# EAGLE design mr_radar_ferret_afe (EAGLE 6.2)
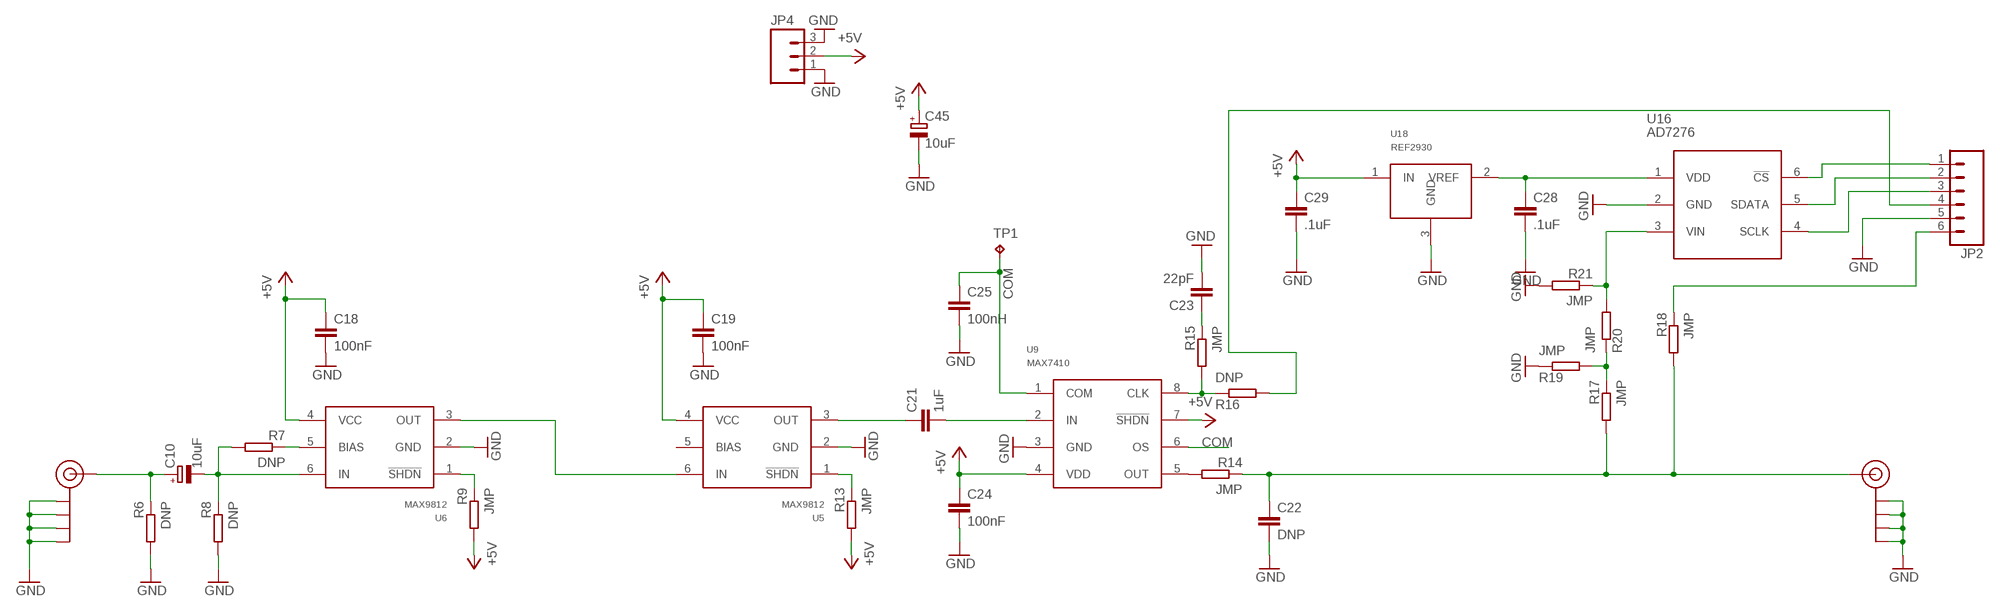
[diagram p0: schematic, sheet 1]

## Parts
C10  10uF  CAPACITOR-POLA  [3216/A]
C18  100nF  CAPACITOR-0603  [0603-CAP]
C19  100nF  CAPACITOR-0603  [0603-CAP]
C21  1uF  CAPACITOR-0603  [0603-CAP]
C22  DNP  CAPACITOR-0603  [0603-CAP]
C23  22pF  CAPACITOR-0603  [0603-CAP]
C24  100nF  CAPACITOR-0603  [0603-CAP]
C25  100nH  CAPACITOR-0603  [0603-CAP]
C28  .1uF  CAPACITOR-0603  [0603-CAP]
C29  .1uF  CAPACITOR-0603  [0603-CAP]
C45  10uF  CAPACITOR-POLA  [3216/A]
J$3  SMA_EDGE  [SMA-EDGE]
J$6  SMA_EDGE  [SMA-EDGE]
JP2  M06SIP  [1X06]
JP4  M03SCREW  [SCREWTERMINAL-3.5MM-3]
R6  DNP  RESISTOR-0603  [0603-RES]
R7  DNP  RESISTOR-0603  [0603-RES]
R8  DNP  RESISTOR-0603  [0603-RES]
R9  JMP  RESISTOR-0603  [0603-RES]
R13  JMP  RESISTOR-0603  [0603-RES]
R14  JMP  RESISTOR-0603  [0603-RES]
R15  JMP  RESISTOR-0603  [0603-RES]
R16  DNP  RESISTOR-0603  [0603-RES]
R17  JMP  RESISTOR-0603  [0603-RES]
R18  JMP  RESISTOR-0603  [0603-RES]
R19  JMP  RESISTOR-0603  [0603-RES]
R20  JMP  RESISTOR-0603  [0603-RES]
R21  JMP  RESISTOR-0603  [0603-RES]
TP1  TPTP14SQ  [TP14SQ]
U5  MAX9812  [SC70-6]
U6  MAX9812  [SC70-6]
U9  MAX7410  [UMAX8]
U16  AD7276  [SOT23-6]
U18  REF2930  [SOT23-3]

## Nets
+5V: C18.P$1 C19.P$1 C24.P$1 C29.P$1 C45.+ JP4.2 R9.P$2 R13.P$2 U5.4(VCC) U6.4(VCC) U9.4(VDD) U9.7(!SHDN) U18.1(IN)
COM: C25.P$1 TP1.TP U9.1(COM) U9.6(OS)
GND: C18.P$2 C19.P$2 C22.P$2 C23.P$2 C24.P$2 C25.P$2 C28.P$2 C29.P$2 C45.- J$3.GND@0(GND) J$3.GND@1(GND) J$3.GND@2(GND) J$3.GND@3(GND) J$6.GND@0(GND) J$6.GND@1(GND) J$6.GND@2(GND) J$6.GND@3(GND) JP2.5 JP4.1 JP4.3 R6.P$2 R8.P$2 R19.P$1 R21.P$2 U5.2(GND) U6.2(GND) U9.3(GND) U16.2(GND) U18.3(GND)
N$1: C10.- R7.P$2 R8.P$1 U6.6(IN)
N$9: U5.6(IN) U6.3(OUT)
N$23: C10.+ J$6.SIG(SIGNAL) R6.P$1
N$25: JP2.4 R16.P$2
N$31: R9.P$1 U6.1(!SHDN)
N$32: R13.P$1 U5.1(!SHDN)
N$33: C21.P$1 U5.3(OUT)
N$34: C21.P$2 U9.2(IN)
N$35: C22.P$1 J$3.SIG(SIGNAL) R14.P$1 R17.P$2 R18.P$2
N$36: R14.P$2 U9.5(OUT)
N$37: R15.P$2 R16.P$1 U9.8(CLK)
N$38: C23.P$1 R15.P$1
N$40: R7.P$1 U6.5(BIAS)
N$42: JP2.3 U16.4(SCLK)
N$43: JP2.1 U16.6(!CS)
N$44: JP2.2 U16.5(SDATA)
N$49: C28.P$1 U16.1(VDD) U18.2(VREF)
N$51: JP2.6 R18.P$1
N$52: R17.P$1 R19.P$2 R20.P$1
N$53: R20.P$2 R21.P$1 U16.3(VIN)
Unconnected: U5.5(BIAS)

## Library data of the parts
C10 C45 = pel_dipol_comp:CAPACITOR-POL
C18 C19 C21-C25 C28 C29 = pel_dipol_comp:CAPACITOR
J$3 J$6 = SparkFun-Connectors:SMA_EDGE: SMA Antenna Connector End launch SMA connector. The paste layer has been removed so that the connector can be hand soldered onto the board after reflow.
JP2 = SparkFun-Connectors:M06: Header 6 Standard 6-pin 0.1" header. Use with straight break away headers (SKU : PRT-00116), right angle break away headers (PRT-00553), swiss pins (PRT-00743), machine pins (PRT-00117), and female headers (PRT-00115). Molex polarized connector foot print use with SKU : PRT-08094 with associated crimp pins and housings. NOTES ON THE VARIANTS LOCK and LOCK_LONGPADS... This footprint was designed to help hold the alignment of a through-hole component (i.e. 6-pin header) while soldering it into place. You may notice that each hole has been shifted either up or down by 0.005 of an inch from it's more standard position (which is a perfectly straight line). This slight alteration caused the pins (the squares in the middle) to touch the edges of the holes. Because they are alternating, it causes a "brace" to hold the component in place. 0.005 has proven to be the perfect amount of "off-center" position when using our standard breakaway headers. Although looks a little odd when you look at the bare footprint, once you have a header in there, the alteration is very hard to notice. Also, if you push a header all the way into place, it is covered up entirely on the bottom side. This idea of altering the position of holes to aid alignment will be further integrated into the Sparkfun Library for other footprints. It can help hold any component with 3 or more connection pins.
JP4 = SparkFun-Connectors:M03: Header 3 Standard 3-pin 0.1" header. Use with straight break away headers (SKU : PRT-00116), right angle break away headers (PRT-00553), swiss pins (PRT-00743), machine pins (PRT-00117), and female headers (PRT-00115). Molex polarized connector foot print use with SKU : PRT-08232 with associated crimp pins and housings.
R6-R9 R13-R21 = pel_dipol_comp:RESISTOR
TP1 = testpad:TP: Test pad
U5 U6 = retro:MAX9812
U9 = retro:MAX7410
U16 = retro:AD7276
U18 = retro:REF2930: CMOS VOLTAGE REFERENCE The REF29xx is a precision, low-power, low-voltage dropout voltage reference family available in a tiny SOT23-3.

## Board
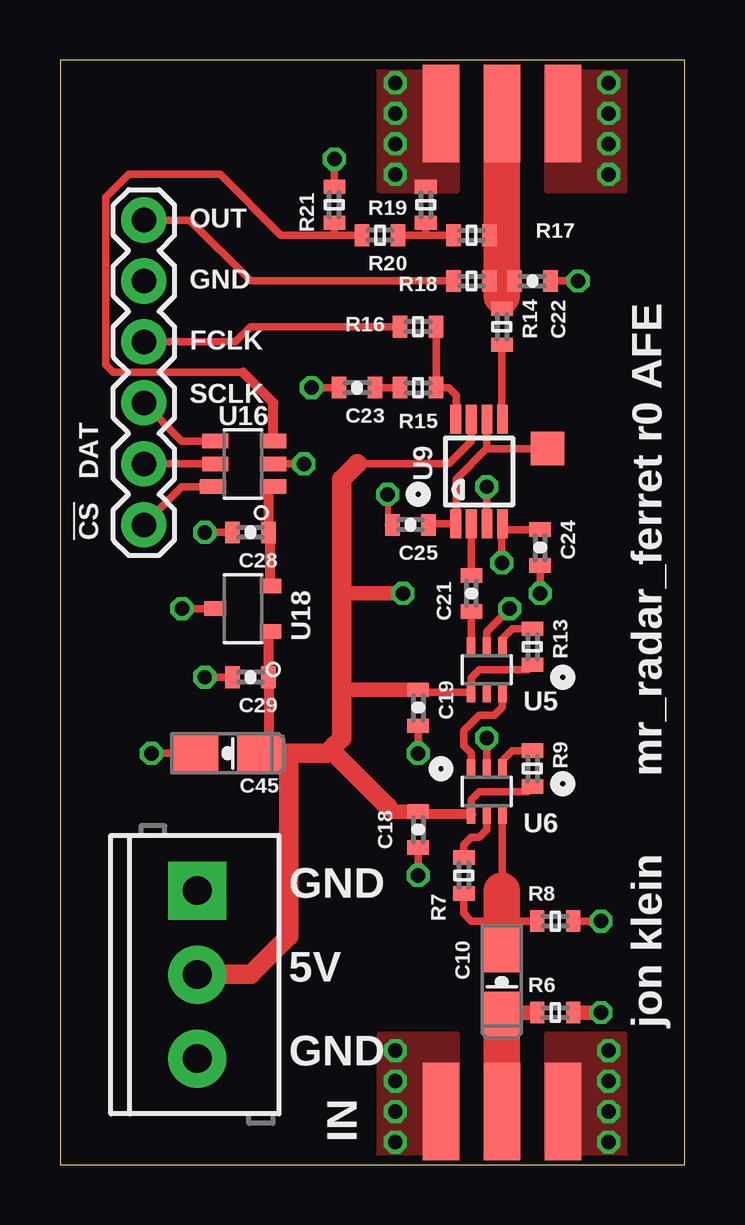
[diagram p1: board, top side]
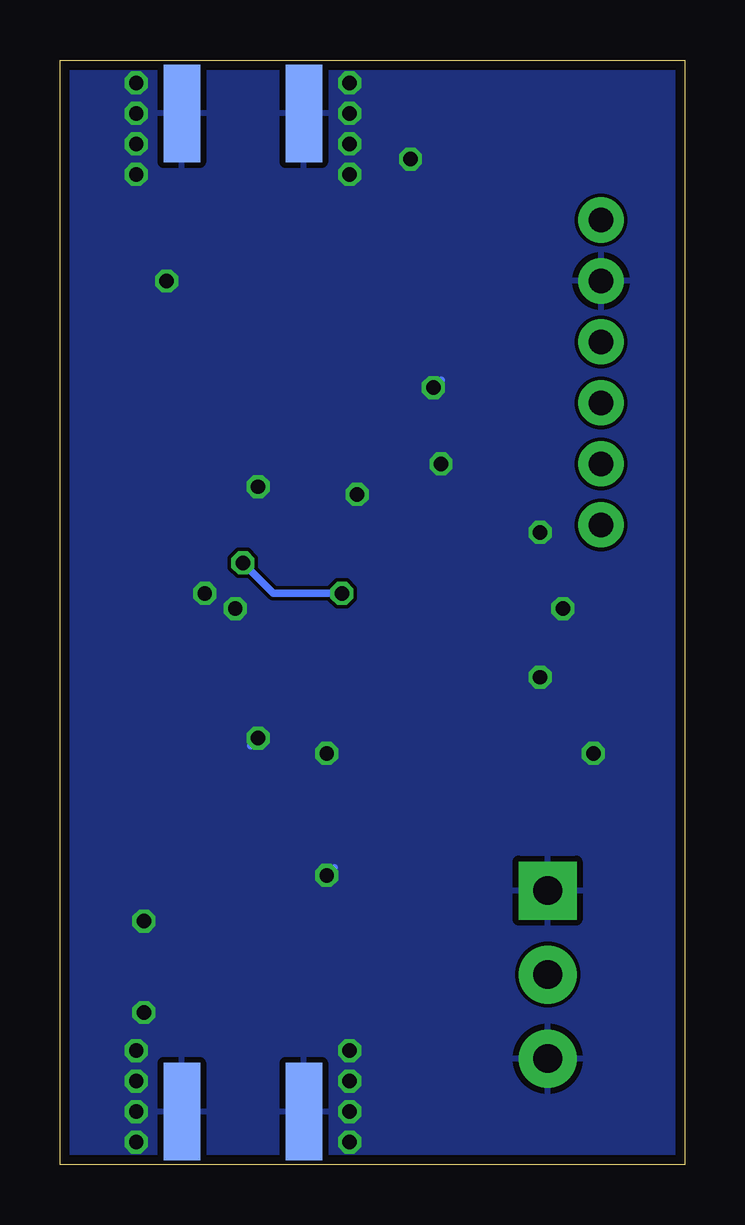
[diagram p2: board, bottom side, seen from below]

Size 26.04 x 46.04 mm. Coordinates in mm from the lower left corner, seen from the top.
Outline: 0,46.04 0,0 26.04,0 26.04,46.04 0,46.04
Copper layers (1*16): Top 0.0356mm / dielectric 1.5011mm / Bottom 0.0356mm
Design rules: minimum track width 6mil, minimum drill 13mil, track to track 6mil, track to pad 6mil, pad to pad 6mil, via to via 6mil, smd to smd 6mil, copper to edge 15mil, drill to drill 6mil, minimum pad ring 7mil, minimum via ring 7mil, stop-mask expansion 4mil, vias tented up to drill 0mil, thermal gap 10mil

### Footprints (pad centres in the part's own frame; a part is rotated, then mirrored left to right if it is on the bottom)
3216/A = smd 1.95 x 1.5: + -1.375,0; - 1.375,0
0603-CAP = smd 0.6 x 0.9: P$1 -0.75,0; P$2 0.75,0
SMA-EDGE = smd 1.524 x 4.064: GND@0 0,0; GND@1 5.08,0; SIG 2.54,0 | smd 1.524 x 4.064 bottom: GND@2 0,0; GND@3 5.08,0
1X06 = drill 1.016 pad 1.88: 1 0,0; 2 2.54,0; 3 5.08,0; 4 7.62,0; 5 10.16,0; 6 12.7,0
SCREWTERMINAL-3.5MM-3 = drill 1.2 pad 2.413 square: 1 0,0 | drill 1.2 pad 2.413: 2 3.5,0; 3 7,0
0603-RES = smd 0.6 x 0.9: P$1 -0.75,0; P$2 0.75,0
TP14SQ = smd 1.4 x 1.4: TP 0,0
SC70-6 = smd 0.35 x 0.8: 1 -0.65,-0.95; 2 0,-0.95; 3 0.65,-0.95; 4 0.65,0.95; 5 0,0.95; 6 -0.65,0.95
UMAX8 = smd 0.45 x 1.2: 1 -0.975,-2.175; 2 -0.325,-2.175; 3 0.325,-2.175; 4 0.975,-2.175; 5 0.975,2.175; 6 0.325,2.175; 7 -0.325,2.175; 8 -0.975,2.175
SOT23-6 = smd 0.6 x 1.1: 1 -0.95,-1.25; 2 0,-1.25; 3 0.95,-1.25; 4 0.95,1.15; 5 0,1.15; 6 -0.95,1.25
SOT23-3 = smd 0.6 x 0.9: 1 -0.95,-1.15; 2 0.95,-1.15; 3 0,1.15

### Placement (x,y rotation side)
C10  18.41,7.62 90 top
C18  14.92,13.97 270 top
C19  14.92,19.05 270 top
C21  17.14,23.81 90 top
C22  19.68,36.83 0 top
C23  12.38,32.38 180 top
C24  20,25.72 270 top
C25  14.6,26.67 180 top
C28  7.94,26.35 180 top
C29  7.94,20.32 180 top
C45  6.98,17.14 180 top
J$3  20.95,43.81 180 top
J$6  20.95,2.22 180 top
JP2  3.49,26.67 90 top
JP4  5.71,11.43 270 top
R6  20.64,6.35 0 top
R7  16.83,12.06 270 top
R8  20.64,10.16 0 top
R9  19.68,16.51 270 top
R13  19.68,21.59 270 top
R14  18.41,34.92 270 top
R15  14.92,32.38 0 top
R16  14.92,34.92 180 top
R17  17.14,38.73 0 top
R18  17.14,36.83 0 top
R19  15.24,40 270 top
R20  13.34,38.73 180 top
R21  11.43,40 90 top
TP1  20.32,29.84 90 top
U5  17.78,20.64 180 top
U6  17.78,15.56 180 top
U9  17.46,28.89 0 top
U16  7.62,29.21 90 top
U18  7.62,23.18 90 top

### Tracks (layer width: path | path; a pad name or v marks a point on that pad's centre or on a via)
+5V  (via drill 0.6)
  Top 0.305: 15.03,14.61 C18.P$1 | C19.P$1 15.04,19.68 15.56,19.68 15.56,19.69 U5.4 17.13,20.3 17.46,20.64 19.48,20.64 R13.P$2 | R9.P$2 19.48,15.56 17.46,15.56 17.13,15.22 U6.4 | U9.7 17.14,30.16 16.19,29.21 12.38,29.21 | C24.P$1 18.44,26.47 U9.4 18.41,26.7 v18.41,25.08 | 8.69,22.14 U18.1 | 8.69,17.47 C45.+
  Top 0.406: 8.69,22.14 C29.P$1 8.69,17.47 | U6.4 14.81,14.61 C18.P$1 | 11.43,17.14 11.43,17.46
  Top 0.61: C19.P$1 11.86,19.8 11.75,19.68 | 13.65,14.92 13.85,14.72 C18.P$1 | v14.29,23.81 11.75,23.81
  Top 0.813: 12.38,29.21 11.75,28.57 11.75,23.81 11.75,19.68 11.75,17.78 11.43,17.46 11.11,17.14 9.52,17.14 | 9.52,17.14 C45.+ | 13.65,14.92 11.43,17.14 | JP4.2 6.04,7.94 7.94,7.94 9.52,9.53 9.52,17.14
  Bottom 0.305: v18.41,25.08 17.14,23.81 v14.29,23.81
COM
  Top 0.305: 17.79,29.85 16.51,28.57 16.51,26.74 U9.1 15.4,26.72 C25.P$1 | 17.79,29.85 U9.6 | 17.79,29.85 17.79,29.84 TP1.TP
GND  (via drill 0.6)
  Top 0.254: v13.65,27.94 13.65,26.67 C25.P$2
  Top 0.305: U6.2 v17.78,17.78 | R8.P$2 v22.54,10.16 | C18.P$2 v14.92,12.06 | C19.P$2 v14.92,17.14 | U5.2 17.78,22.23 v18.73,23.18 | U9.3 v17.78,28.26 | C23.P$2 v10.48,32.38 | C22.P$2 v21.59,36.83 | C24.P$2 v20,23.81 | U16.2 v10.16,29.21 | C28.P$2 v6.03,26.35 | U18.3 v5.08,23.18 | C29.P$2 v6.03,20.32 | C45.- v3.81,17.14 | R21.P$2 v11.43,41.91
  Top 0.61: R6.P$2 v22.54,6.35
  Bottom 0.305: v17.78,17.78 18.1,17.46 | v22.54,10.16 22.86,10.16 | v14.92,12.06 14.6,12.38 | v18.73,23.18 18.41,23.18 | v17.78,28.26 18.1,28.26 | v10.48,32.38 10.16,32.7 | v21.59,36.83 21.59,36.51 | v10.16,29.21 10.48,29.21 | v6.03,26.35 5.71,26.35 | v5.08,23.18 5.08,23.49 | v6.03,20.32 5.71,20.32 | v3.81,17.14 3.49,17.14 | v11.43,41.91 11.43,42.23
  other vias: 13.97,45.09 13.97,43.81 13.97,42.54 13.97,41.27 22.86,45.09 22.86,43.81 22.86,42.54 22.86,41.27 22.86,4.76 22.86,3.49 22.86,2.22 22.86,0.95 13.97,4.76 13.97,3.49 13.97,2.22 13.97,0.95
  pour Top (no thermals): 13.34,40.64 16.51,40.64 16.51,45.72 13.34,45.72
  pour Top (no thermals): 20.32,40.64 23.49,40.64 23.49,45.72 20.32,45.72
  pour Top (no thermals): 20.32,0.32 23.49,0.32 23.49,5.4 20.32,5.4
  pour Top (no thermals): 13.34,0.32 16.51,0.32 16.51,5.4 13.34,5.4
  pour Bottom: -3.81,46.35 -4.13,46.35 -4.13,-2.86 28.89,-2.86 28.89,46.99 -3.81,46.99
N$1
  Top 0.305: U6.6 18.43,11.44 arc-90 18.41,11.43 | R7.P$2 16.83,10.48 17.14,10.16 18.41,10.16 R8.P$1
  Top 1.524: C10.- 18.41,10.16 18.41,11.43
N$9
  Top 0.305: U6.3 17.13,17.16 16.83,17.46 16.83,18.1 17.46,18.73 18.1,18.73 18.43,19.06 U5.6
N$23
  Top 0.61: R6.P$1 18.52,6.35 arc90 C10.+
  Top 1.524: J$6.SIG C10.+
N$25
  Top 0.305: R16.P$2 7.94,34.92 7.3,34.29 JP2.4
N$31
  Top 0.305: U6.1 18.41,16.52 18.41,16.83 18.85,17.26 R9.P$1
N$32
  Top 0.305: U5.1 18.41,21.6 18.41,21.91 18.85,22.34 R13.P$1
N$33
  Top 0.305: C21.P$1 17.13,23.05 U5.3
N$34
  Top 0.305: C21.P$2 U9.2
N$35
  Top 0.305: R14.P$1 18.41,36.2 | C22.P$1 18.41,36.83 | R18.P$2 18.27,38.64 | 18.27,38.64 18.41,39.37 | R17.P$2 17.99,38.64 18.27,38.64
  Top 1.524: 18.41,36.2 18.41,36.83 18.41,39.37 J$3.SIG
N$36
  Top 0.305: U9.5 18.41,31.09 R14.P$2
N$37
  Top 0.305: U9.8 16.51,31.09 16.51,32.07 16.19,32.38 R15.P$2 R16.P$1
N$38
  Top 0.305: C23.P$1 R15.P$1
N$40
  Top 0.305: R7.P$1 16.83,13.33 17.14,13.65 17.46,13.65 17.78,13.97 U6.5
N$42
  Top 0.305: U16.4 5.08,30.16 JP2.3
N$43
  Top 0.305: U16.6 5.08,28.26 JP2.1
N$44
  Top 0.305: U16.5 JP2.2
N$49
  Top 0.305: 8.77,26.27 C28.P$1 | 8.69,28.08 U16.1
  Top 0.406: U18.2 8.77,26.27 | C28.P$1 8.69,28.08
N$51
  Top 0.305: R18.P$1 7.94,36.83 5.4,39.37 JP2.6
N$52
  Top 0.305: R17.P$1 15.24,38.73 | 15.24,38.73 R20.P$1 | R19.P$2 15.24,38.73
N$53
  Top 0.305: U16.3 8.89,30.18 | R20.P$2 11.43,38.73 | 11.43,38.73 9.21,38.73 6.67,41.27 2.86,41.27 1.9,40.32 1.9,33.34 2.22,33.02 7.62,33.02 | R21.P$1 11.43,38.73
  Top 0.406: 8.89,30.18 8.89,31.75 7.62,33.02

### Text on the board
_tsilk: OUT | GND | FCLK | SCLK | DAT | !CS | mr_radar_ferret r0 AFE | GND | 5V | jon klein | GND | IN